# Altium schematic sheet MainScales.SchDoc
size 297 x 209 mm; SheetNumber: 2; SheetTotal: 3
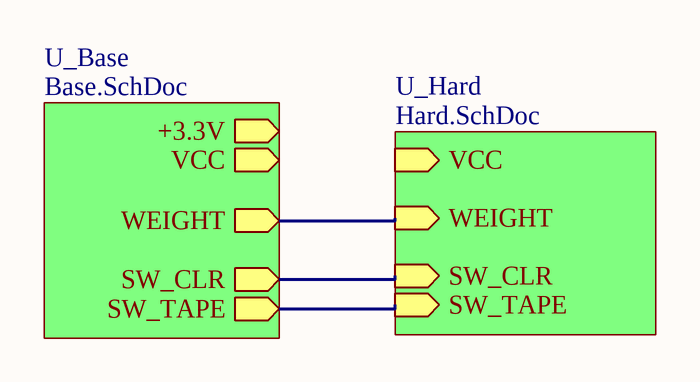
[diagram p0: MainScales.SchDoc]

## Sub-sheets
U_Base = Base.SchDoc: SW_TAPE (out), SW_CLR (out), +3.3V (out), WEIGHT (out), VCC (out)
U_Hard = Hard.SchDoc: WEIGHT (in), VCC (in), SW_CLR (in), SW_TAPE (in)

## Nets
(unnamed): sheet U_Base/SW_TAPE, sheet U_Hard/SW_TAPE
(unnamed): sheet U_Base/SW_CLR, sheet U_Hard/SW_CLR
(unnamed): sheet U_Base/WEIGHT, sheet U_Hard/WEIGHT

## Notes on the sheet
- Author
- Manufacturer
- Date
- Page
- Total pages
- Size page
- A4
- Materials